# Altium schematic sheet Power.SchDoc
size A4
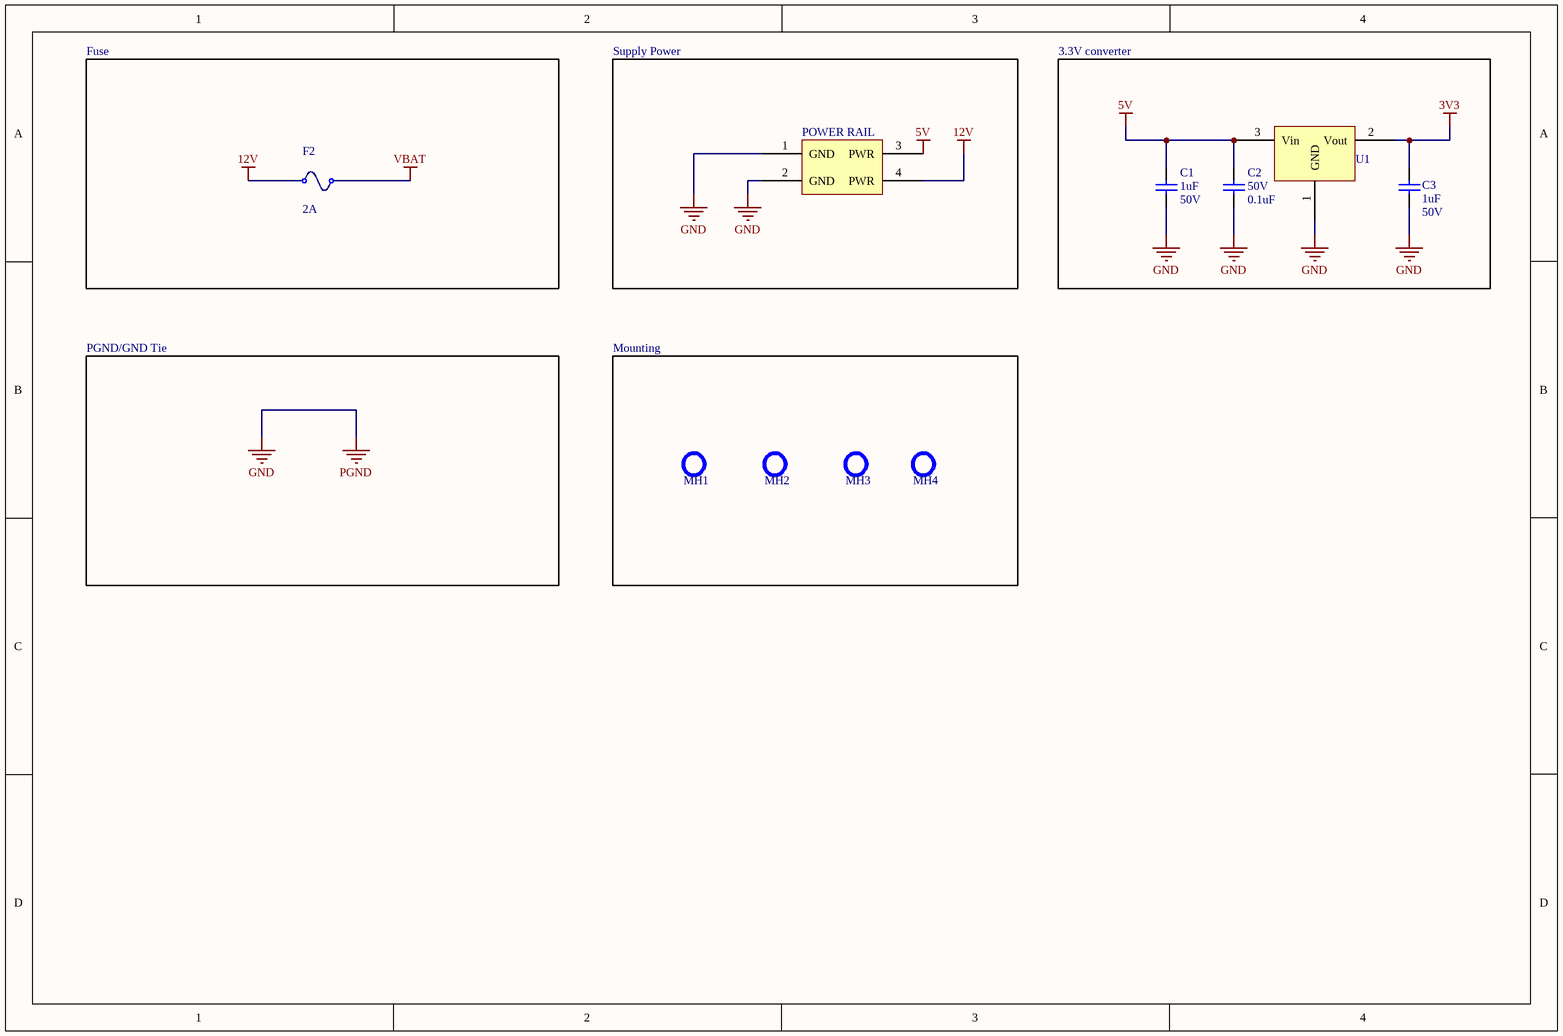
[diagram p0: Power.SchDoc]

## Parts
C1  Capacitance: 1uF  Voltage: 50V  [0803 CAP]  (hidden comment: CL21B105KBFNNNG)
C2  Voltage: 50V  Capacitance: 0.1uF  [FP-CL10-0_1-IPC_A]  (hidden comment: CL10B104JB8NNNC)
C3  Capacitance: 1uF  Voltage: 50V  [0803 CAP]  (hidden comment: CL21B105KBFNNNG)
F2  Current Rating: 2A  [RESC1206(3216)]  (hidden comment: SMD Fuse, 2A, 63VAC, Slow Blow)
MH1  Mounting Hole, M3, Unplated  [Clearance_M3_UNPLATED]  (value not drawn)  (no BOM)
MH2  Mounting Hole, M3, Unplated  [Clearance_M3_UNPLATED]  (value not drawn)  (no BOM)
MH3  Mounting Hole, M3, Unplated  [Clearance_M3_UNPLATED]  (value not drawn)  (no BOM)
MH4  Mounting Hole, M3, Unplated  [Clearance_M3_UNPLATED]  (value not drawn)  (no BOM)
POWER_RAIL  Header, Female, 2x2, RIght Angle, Pitch: 0.118"  (3.00mm), THT  [2x2 Pitch 118mil connector]  (value not drawn)
U1  3.3V 250mA Linear Reg LDO  [SOT95P245X110-3N]  (value not drawn)

## Blocks framed on the sheet
Fuse: F2
Supply Power: POWER_RAIL
3.3V converter: C1-C3 U1
Mounting: MH1-MH4

## Nets
3V3: C3.2 U1.2(Vout)
5V: C1.2 C2.2 POWER_RAIL.3(PWR) U1.3(Vin)
12V: F2.1 POWER_RAIL.4(PWR)
GND: C1.1 C2.1 C3.1 POWER_RAIL.1(GND) POWER_RAIL.2(GND) U1.1(GND)  [also labelled PGND]
VBAT: F2.2

## Notes on the sheet
- PGND/GND Tie

## Library data of the parts
C1 C3 = CMP-00005-3: SAMSUNG ELECTRO-MECHANICS - CL21B105KBFNNNG - MLCC CAPACITORS; Dielectric: X7R; Tolerance: 10%; Material: Ceramic; Min Operating Temperature: -55°C; Length: 2mm; Termination: Wraparound; Contact Plating: Tin; Package Quantity: 3000; Mount: Surface Mount; Max Operating Temperature: 125°C; Case Code (Imperial): 0805; Thickness: 0.053inch; Case/Package: 0805; Width: 0.049inch; Voltage Rating: 50V; Depth: 1.25mm; Packaging: Tape and Reel; Case Code (Metric): 2012
C2 = CMP-00000-4: CAP CER 0.1UF 50V X7R 0603; Tolerance: 5%; Material: Ceramic; Case Code (Imperial): 0603; Mount: Surface Mount; Thickness: 0.035inch; Depth: 0.8mm; Packaging: Tape and Reel; Package Quantity: 1; Dielectric: X7R; Height: 0.8mm; Radiation Hardening: No; Max Operating Temperature: 125°C; Voltage Rating: 50V; Case/Package: 0603; Min Operating Temperature: -55°C; Case Code (Metric): 1608; Length: 1.6mm; Contact Plating: Tin; Width: 0.031inch
F2 = CMP-00009-1: Fuse, Smd, 2A, Slow Blow, 1206; Fuse Type: Board Mount (Cartridge Style Excluded); Approvals: CE,cURus; Voltage Rating (AC): 63V; DC Cold Resistance: 123mR; Case Code (Metric): 3216; Min Operating Temperature: -55°C; Case/Package: 1206; Max Operating Temperature: 125°C; Mount: Surface Mount; Voltage Rating (DC): 63V; Case Code (Imperial): 1206; Packaging: Tape and Reel
MH1-MH4 = CMP-053-0001-1: Pin Count: 0; Created By: Ashwin Sira; Date Created: 2016-06-08; Design Item ID: Mounting Hole, M3, Unplated; Publisher: AUVic; Component Type: Standard (No BOM); Source: AUVic_Integrated_Library_Virtual_Components.SchLib
POWER_RAIL = CMP-005-0021-4: Connector Header Through Hole, Right Angle 4 position 0.118" (3.00mm); Design Item ID: Header, Female, 2x2, RIght Angle, Pitch: 0.118"  (3.00mm), THT; Publisher: AUVic; Component Type: Standard; Created By: Poorna Chander Kalidas; Source: AUVic_Schematic_Library_Connectors.SchLib; Date Published: 2020-05-16; Pin Count: 4
U1 = CMP-00003-1: IC REG LINEAR 3.3V 250MA SOT23-3; Max Input Voltage: 6.6V; Accuracy: 2%; Polarity: Positive; Number of Outputs: 1; Output Type: Fixed; Dropout Voltage: 400mV; Quiescent Current: 1uA; Min Input Voltage: 2.5V; Min Operating Temperature: -40°C; Supplier 1: Digi-Key; Supplier Part Number 1: AP2138N-3.3TRG1; Width: 1.7mm; Length: 3.02mm; Height: 1.3mm; Output Current: 250mA; Created By: Poorna Chander Kalidas; Number of Regulators: 1; Number of Pins: 3; Package Quantity: 3000; Date Created: June 26, 2020; Output Voltage: 3.3V; Max Operating Temperature: 85°C; Max Output Current: 250mA; Weight: 0.000282oz; Packaging: Tape and Reel; Lead Free: Lead Free; Mount: Surface Mount; Case/Package: SOT-23-3